# EAGLE design wide_con (EAGLE 4.16)
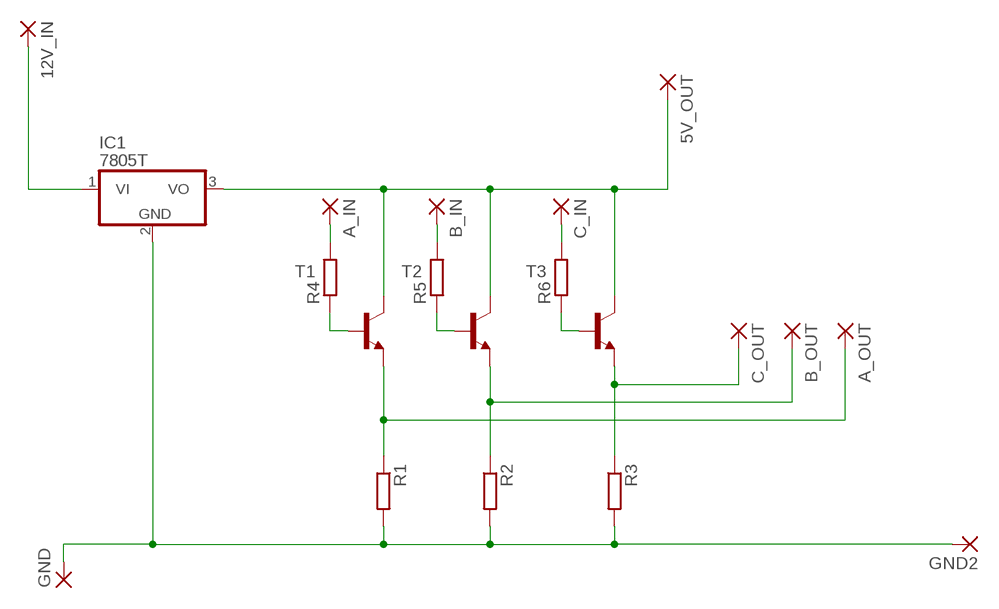
[diagram p0: schematic, sheet 1]

## Parts
5V_OUT  2,54/0,8  [2,54/0,8]
12V_IN  2,54/0,8  [2,54/0,8]
A_IN  2,54/0,8  [2,54/0,8]
A_OUT  2,54/0,8  [2,54/0,8]
B_IN  2,54/0,8  [2,54/0,8]
B_OUT  2,54/0,8  [2,54/0,8]
C_IN  2,54/0,8  [2,54/0,8]
C_OUT  2,54/0,8  [2,54/0,8]
GND  2,54/0,8  [2,54/0,8]
GND2  2,54/0,8  [2,54/0,8]
IC1  7805T  [TO220H]
R1  R-EU_0309/12  [0309/12]
R2  R-EU_0309/12  [0309/12]
R3  R-EU_0309/12  [0309/12]
R4  R-EU_0309/12  [0309/12]
R5  R-EU_0309/12  [0309/12]
R6  R-EU_0309/12  [0309/12]
T1  BC639-NPN-TO92-BCE  [TO92-BCE]
T2  BC639-NPN-TO92-BCE  [TO92-BCE]
T3  BC639-NPN-TO92-BCE  [TO92-BCE]

## Nets
B_OUT: B_OUT.1(P) R2.1 T2.E
GND: GND2.1(P) GND.1(P) IC1.2(GND) R1.2 R2.2 R3.2
N$1: A_OUT.1(P) R1.1 T1.E
N$3: C_OUT.1(P) R3.1 T3.E
N$4: R4.1 T1.B
N$5: R5.1 T2.B
N$6: R6.1 T3.B
N$8: 5V_OUT.1(P) IC1.3(VO) T1.C T2.C T3.C
N$9: A_IN.1(P) R4.2
N$10: 12V_IN.1(P) IC1.1(VI)
N$11: B_IN.1(P) R5.2
N$12: C_IN.1(P) R6.2

## Library data of the parts
5V_OUT 12V_IN A_IN A_OUT B_IN B_OUT C_IN C_OUT GND GND2 = wirepad:2,54/0,8: THROUGH-HOLE PAD
IC1 = linear:78*: Positive VOLTAGE REGULATOR Source: http://cache.national.com/ds/LM/LM78L05.pdf http://www.fairchildsemi.com/ds/LM/LM7805.pdf
R1-R6 = rcl:R-EU_: RESISTOR, European symbol
T1-T3 = transistor:*-NPN-: NPN Transistror

## Board
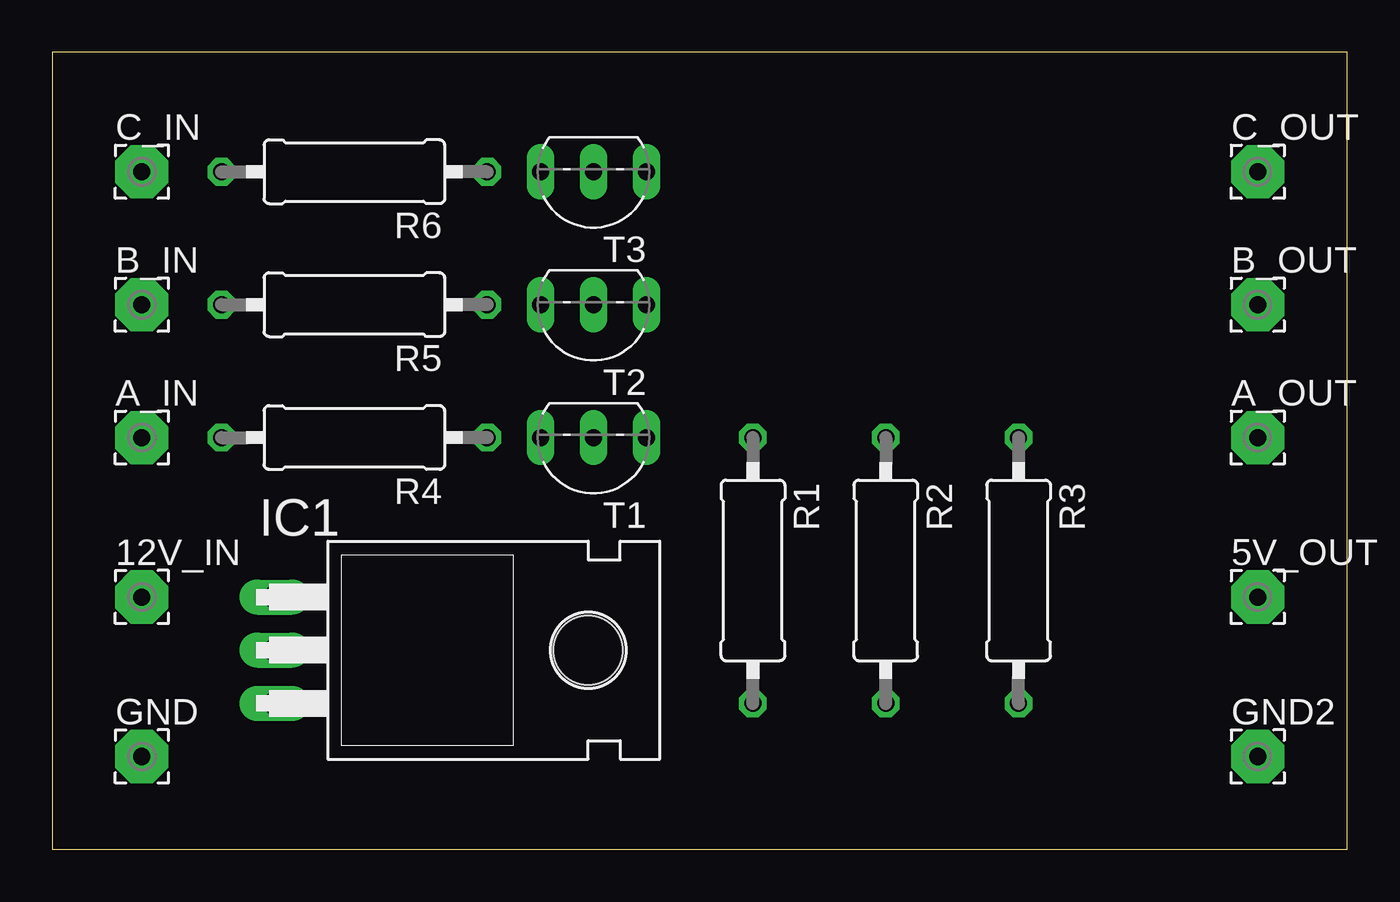
[diagram p1: board, top side]
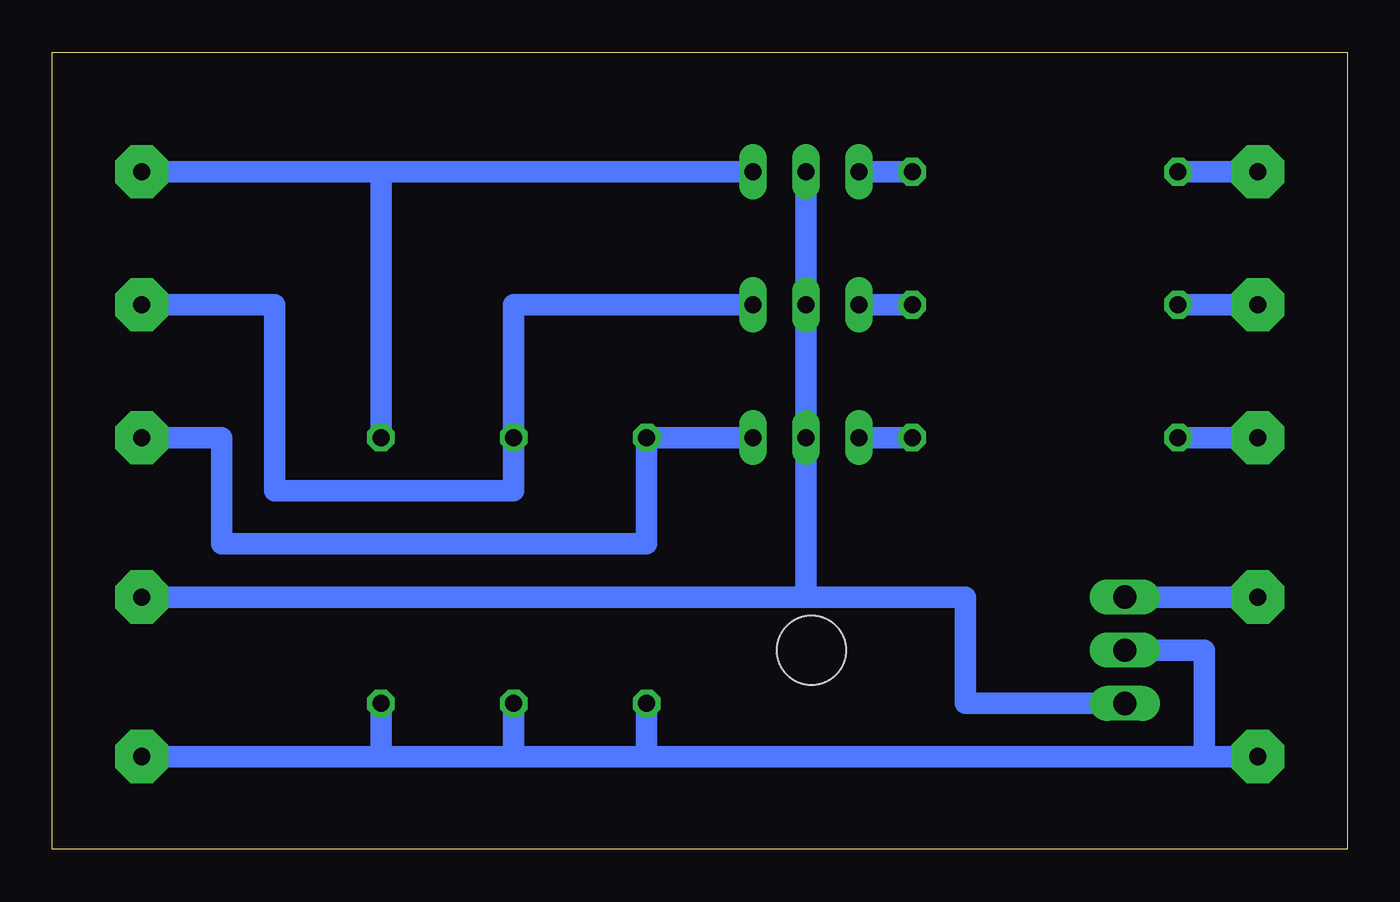
[diagram p2: board, bottom side, seen from below]

Size 61.9 x 38.09 mm. Coordinates in mm from the lower left corner, seen from the top.
Outline: 0,0 61.9,0 61.9,38.09 0,38.09 0,0
Copper layers (1*16): Top 0.035mm / dielectric 1.5mm / Bottom 0.035mm
Design rules "default": minimum track width 10mil, minimum drill 24mil, track to track 8mil, track to pad 8mil, pad to pad 8mil, via to via 8mil, smd to smd 8mil, copper to edge 40mil, drill to drill 8mil, minimum pad ring 10mil, minimum via ring 8mil, stop-mask expansion 4mil, vias tented up to drill 0mil, thermal gap 10mil

### Footprints (pad centres in the part's own frame; a part is rotated, then mirrored left to right if it is on the bottom)
2,54/0,8 = drill 0.813 pad 2.54 octagon: 1 0,0
TO220H = drill 1.118 long: 1 -2.54,-10.16; 2 0,-10.16; 3 2.54,-10.16 | hole 3.302: 0,4.826
0309/12 = drill 0.813 octagon: 1 -6.35,0; 2 6.35,0
TO92-BCE = drill 0.813 long: B 2.54,0; C 0,0; E -2.54,0

### Placement (x,y rotation side)
5V_OUT  57.62,12.06 0 top
12V_IN  4.28,12.06 0 top
A_IN  4.28,19.68 0 top
A_OUT  57.62,19.68 0 top
B_IN  4.28,26.03 0 top
B_OUT  57.62,26.03 0 top
C_IN  4.28,32.38 0 top
C_OUT  57.62,32.38 0 top
GND  4.28,4.44 0 top
GND2  57.62,4.44 0 top
IC1  20.79,9.52 270 top
R1  33.49,13.33 270 top
R2  39.84,13.33 270 top
R3  46.19,13.33 270 top
R4  14.44,19.68 180 top
R5  14.44,26.03 180 top
R6  14.44,32.38 180 top
T1  25.87,19.68 180 top
T2  25.87,26.03 180 top
T3  25.87,32.38 180 top

### Tracks (layer width: path | path; a pad name or v marks a point on that pad's centre or on a via)
B_OUT
  Bottom 1.016: B_OUT.1 51.27,26.03 51.27,17.14 39.84,17.14 R2.1 39.84,26.03 T2.E
GND
  Bottom 1.016: 46.19,4.44 GND2.1 | 6.82,4.44 33.49,4.44 | 33.49,4.44 R1.2 | IC1.2 6.82,9.52 6.82,4.44 | GND.1 6.82,4.44 | 46.19,4.44 R3.2 | 39.84,4.44 46.19,4.44 | 39.84,4.44 R2.2 | 33.49,4.44 39.84,4.44
N$1
  Bottom 1.016: A_OUT.1 53.81,19.68 53.81,14.6 33.49,14.6 R1.1 T1.E
N$3
  Bottom 1.016: T3.E 46.19,32.38 | 46.19,32.38 R3.1 | 46.19,32.38 C_OUT.1
N$4
  Bottom 1.016: R4.1 T1.B
N$5
  Bottom 1.016: R5.1 T2.B
N$6
  Bottom 1.016: R6.1 T3.B
N$8
  Bottom 1.016: 25.87,12.06 T1.C T2.C T3.C | 25.87,12.06 5V_OUT.1 | IC1.3 18.25,6.98 18.25,12.06 25.87,12.06
N$9
  Bottom 1.016: A_IN.1 R4.2
N$10
  Bottom 1.016: 12V_IN.1 IC1.1
N$11
  Bottom 1.016: B_IN.1 R5.2
N$12
  Bottom 1.016: C_IN.1 R6.2